# Altium schematic sheet TEST_HJ-185.SchDoc: Test Board
size 419 x 297 mm; Organization: FFT; Address1: Lambertu iela 9; Address2: Marupe; Address3: LV-2167; Address4: Latvia; Revision: E; SheetNumber: 1; SheetTotal: 1; ID: HJ-185 Bluetooth
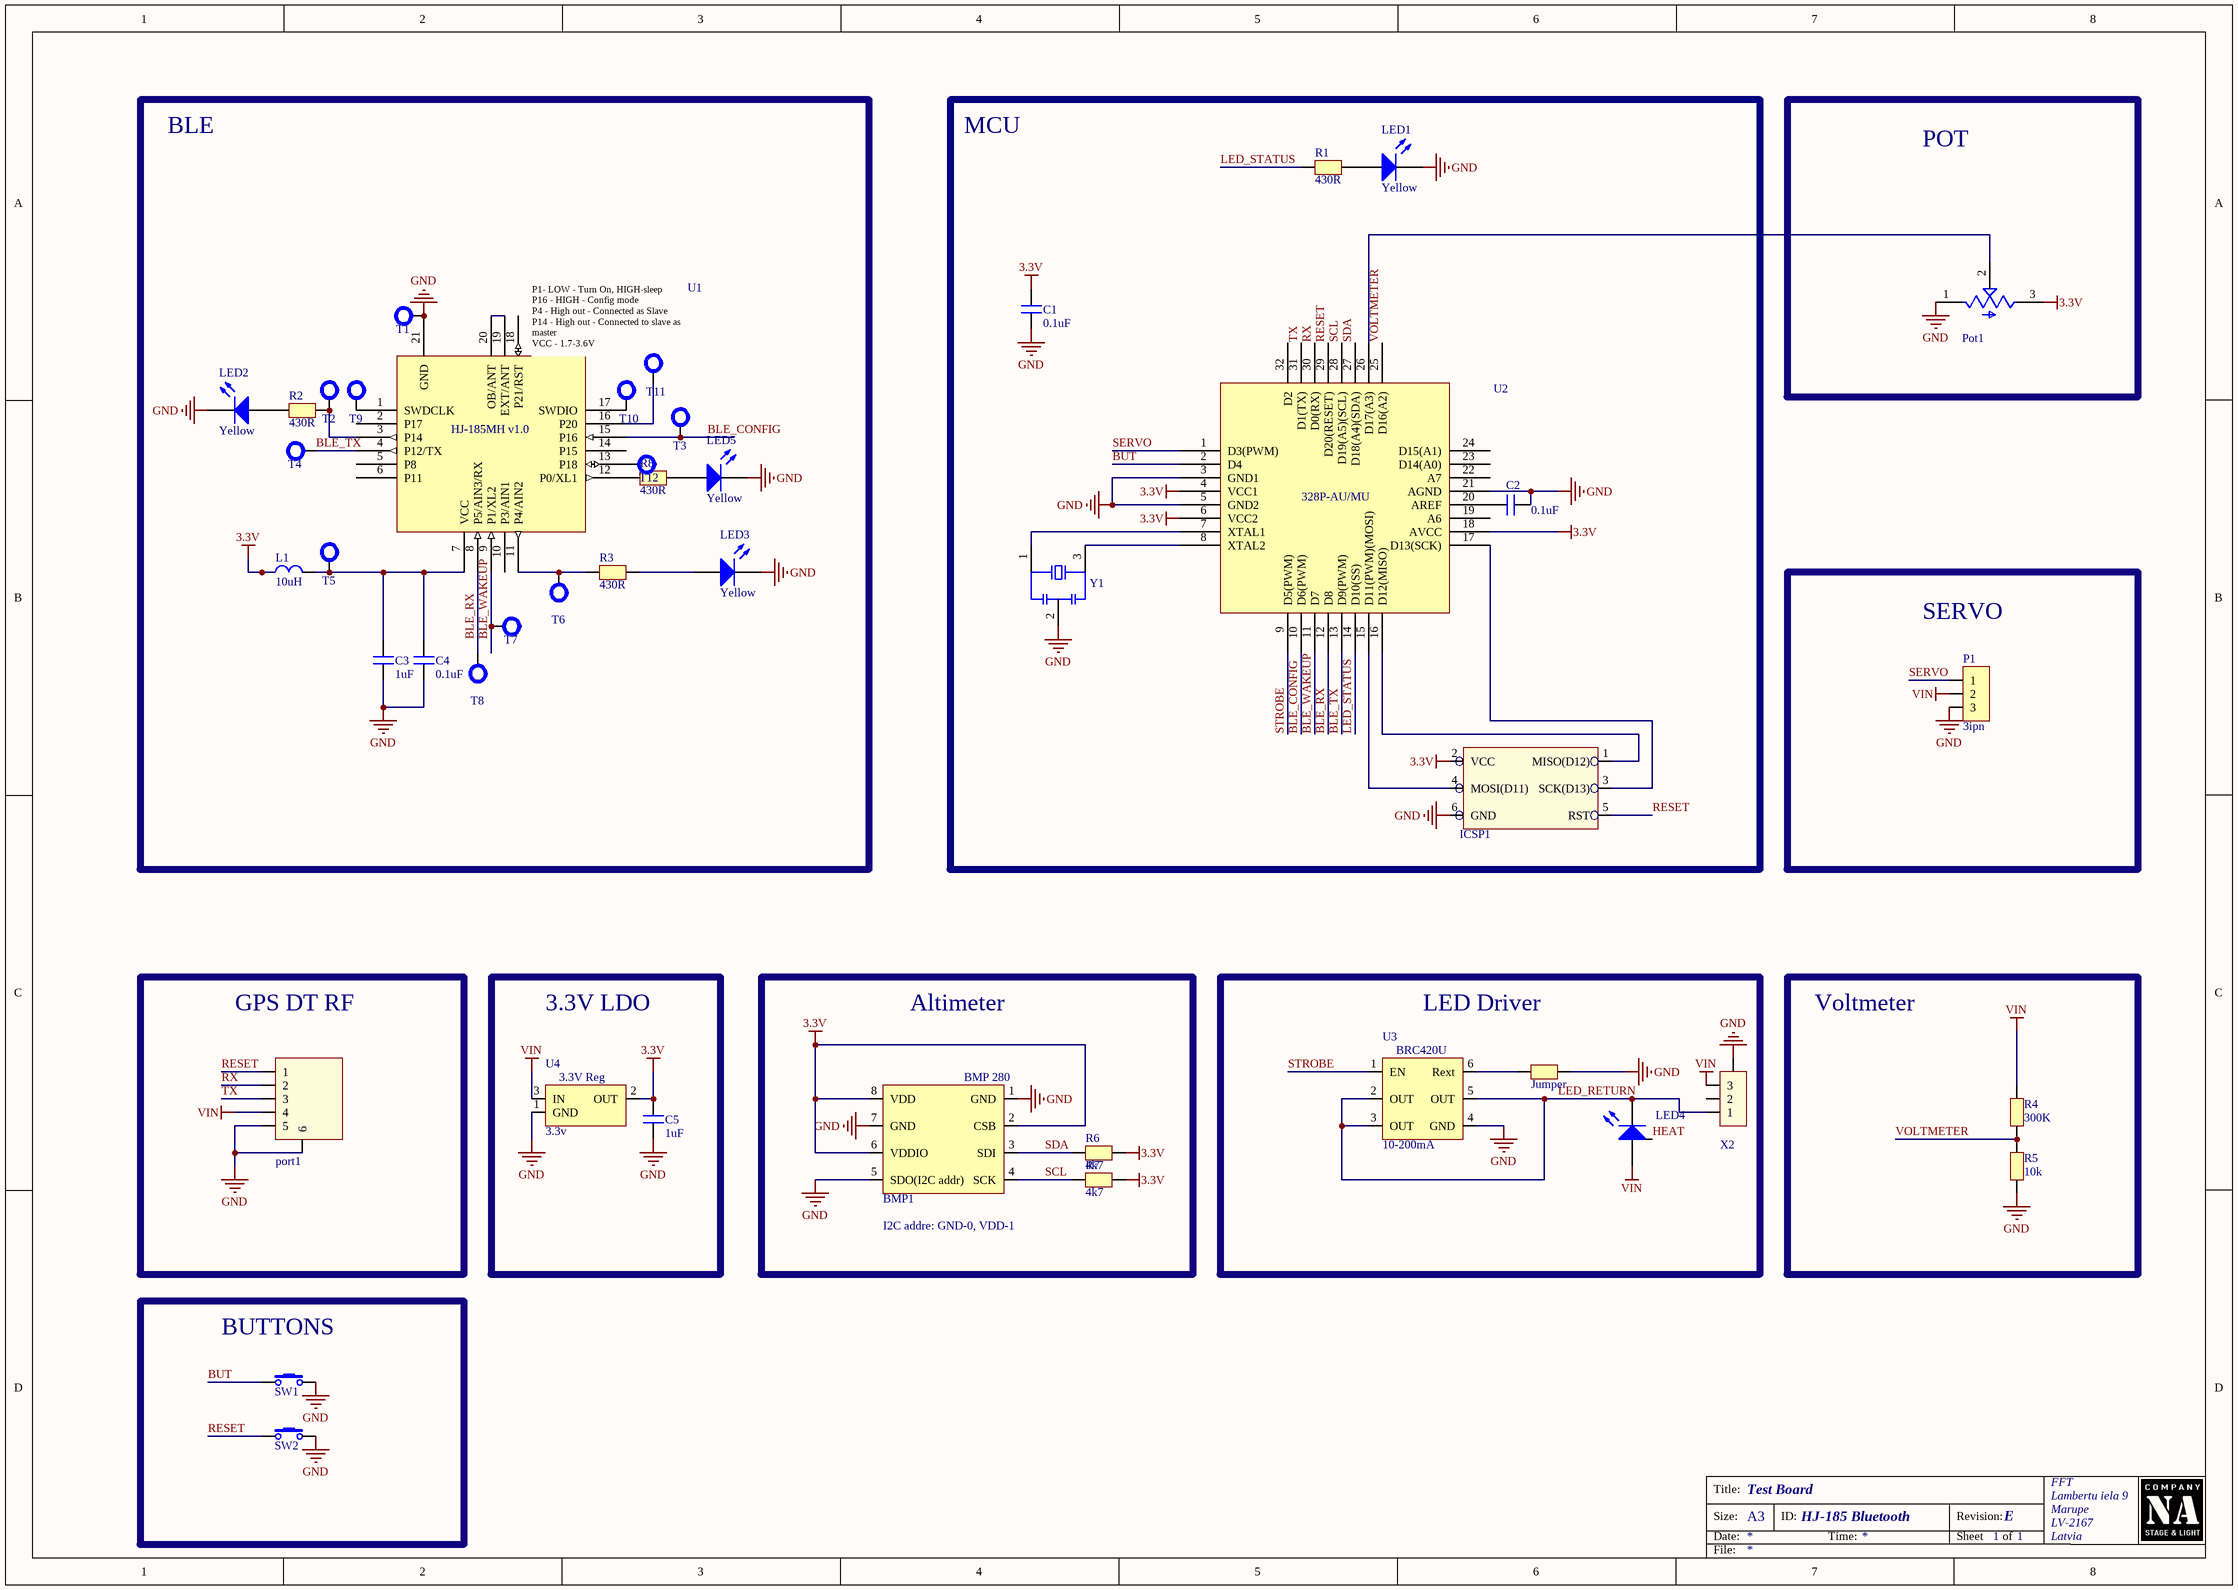
[diagram p0: TEST_HJ-185.SchDoc]

## Parts
BMP1  ± 0.12 hPa equivalent to ±1 m  [BMP280]  (value not drawn)
C1  0.1uF  [C0603-FFT]
C2  0.1uF  [C0603-FFT]
C3  1uF  [C0603-FFT]
C4  0.1uF  [C0603-FFT]
C5  1uF  [C0603-FFT]
ICSP1  Progr ICSP  [ICSP prg PIN 2.54mm]  (value not drawn)  (no BOM)
L1  10uH  [L0603]
LED1  Yellow  [LED0603]
LED2  Yellow  [LED0603]
LED3  Yellow  [LED0603]
LED4  Cool White  [CREE XPL]  (value not drawn)
LED5  Yellow  [LED0603]
P1  3ipn  [HDR1x3]
port1  1.0mm 5pin  [JST 5pin 1mm]  (value not drawn)
Pot1  TC33X-10K  [TrimPot - TC33X-2-101G]  (value not drawn)
R1  430R  [R0603-FFT]
R2  430R  [R0603-FFT]
R3  430R  [R0603-FFT]
R4  300K  [R0603-FFT]
R5  10k  [R0603-FFT]
R6  4k7  [R0603-FFT]
R7  4k7  [R0603-FFT]
R8  430R  [R0603-FFT]
SW1  (no value)  [Switch Tactile SKRPACE010]
SW2  (no value)  [Switch Tactile TS-1088C]
T1  ?  [Test Point]  (value not drawn)  (no BOM)
T2  ?  [Test Point]  (value not drawn)  (no BOM)
T3  ?  [Test Point]  (value not drawn)  (no BOM)
T4  ?  [Test Point]  (value not drawn)  (no BOM)
T5  ?  [Test Point]  (value not drawn)  (no BOM)
T6  ?  [Test Point]  (value not drawn)  (no BOM)
T7  ?  [Test Point]  (value not drawn)  (no BOM)
T8  ?  [Test Point]  (value not drawn)  (no BOM)
T9  ?  [Test Point]  (value not drawn)  (no BOM)
T10  ?  [Test Point]  (value not drawn)  (no BOM)
T11  ?  [Test Point]  (value not drawn)  (no BOM)
T12  ?  [Test Point]  (value not drawn)  (no BOM)
U1  (no value)  [LGA-24-fft]
U2  (no value)  [32-pin QFP 10mm]
U3  10-200mA  [SC74]
U4  3.3v  [SOT23-3]
X1  Jumper  [0603 clear pad]  (no BOM)
X2  1.0mm 3pin  [JST 3pin 1mm]  (value not drawn)
Y1  CSTCE8M0V53-R0  [OSC_CSTCE16M0V53-R0]  (value not drawn)

## Blocks framed on the sheet
BLE: C3 C4 L1 LED2 LED3 LED5 R2 R3 R8 T1-T12 U1
MCU: C1 C2 ICSP1 LED1 R1 U2 Y1
POT: Pot1
SERVO: P1
GPS DT RF: port1
3.3V LDO: C5 U4
Altimeter: BMP1 R6 R7
LED Driver: LED4 U3 X1 X2
Voltmeter: R4 R5
BUTTONS: SW1 SW2

## Nets
3.3V: BMP1.2(CSB) BMP1.6(VDDIO) BMP1.8(VDD) C1.2 C5.2 ICSP1.2(VCC) L1.1 Pot1.3(CW) R6.2 R7.2 U2.4(VCC1) U2.6(VCC2) U2.18(AVCC) U4.2(OUT)
GND: BMP1.1(GND) BMP1.5(SDO(I2C_addr)) BMP1.7(GND) C1.1 C2.2 C3.1 C4.1 C5.1 ICSP1.6(GND) LED1.C LED2.C LED3.C LED5.C P1.3 port1.5 port1.6 Pot1.1(CCW) R5.1 SW1.2 SW2.2 T1.1 U1.21(GND) U2.3(GND1) U2.5(GND2) U2.21(AGND) U3.4(GND) U4.1(GND) X1.1 X2.6(GND) Y1.2(OSC2)
VIN: LED4.A P1.2 port1.4 R4.2 U4.3(IN) X2.3
BLE_CONFIG: T3.1 U1.15(P16) U2.10(D6(PWM))
BLE_RX: T8.1 U1.8(P5/AIN3/RX) U2.12(D8)
BLE_TX: T4.1 U1.4(P12/TX) U2.13(D9(PWM))
BLE_WAKEUP: T7.1 U1.9(P1/XL2) U2.11(D7)
BUT: SW1.1 U2.2(D4)
HEAT: LED4.PAD(P)
LED_RETURN: LED4.K U3.2(OUT) U3.3(OUT) U3.5(OUT) X2.1
LED_STATUS: R1.1 U2.14(D10(SS))
RESET: ICSP1.5(RST) port1.1 SW2.1 U2.29(D20(RESET))
RX: port1.2 U2.30(D0(RX))
SCL: BMP1.4(SCK) R7.1 U2.28(D19(A5)(SCL))
SDA: BMP1.3(SDI) R6.1 U2.27(D18(A4)(SDA))
SERVO: P1.1 U2.1(D3(PWM))
STROBE: U2.9(D5(PWM)) U3.1(EN)
TX: port1.3 U2.31(D1(TX))
VOLTMETER: R4.1 R5.2 U2.25(D16(A2))
NetC2_1: C2.1 U2.20(AREF)
NetC3_2: C3.2 C4.2 L1.2 T5.1 U1.7(VCC)
NetICSP1_1: ICSP1.1(MISO(D12)) U2.16(D12(MISO))
NetICSP1_3: ICSP1.3(SCK(D13)) U2.17(D13(SCK))
NetICSP1_4: ICSP1.4(MOSI(D11)) U2.15(D11(PWM)(MOSI))
NetLED1_A: LED1.A R1.2
NetLED2_A: LED2.A R2.2
NetLED3_A: LED3.A R3.2
NetLED5_A: LED5.A R8.2
NetPot1_2: Pot1.2(W) U2.26(D17(A3))
NetR2_1: R2.1 T2.1 U1.3(P14)
NetR3_1: R3.1 T6.1 U1.11(P4/AIN2)
NetR8_1: R8.1 U1.12(P0/XL1)
NetT9_1: T9.1 U1.1(SWDCLK)
NetT10_1: T10.1 U1.17(SWDIO)
NetT11_1: T11.1 U1.16(P20)
NetT12_1: T12.1 U1.13(P18)
NetU1_19: U1.19(EXT/ANT) U1.20(OB/ANT)
NetU2_7: U2.7(XTAL1) Y1.1(OSC1)
NetU2_8: U2.8(XTAL2) Y1.3(OSC3)
NetU3_6: U3.6(Rext) X1.2

Not connected (* = marked no-connect by the designer): U1 2(P17) 5(P8) 6(P11) 10(P3/AIN1) 14(P15) 18(P21/RST); U2 19(A6) 22(A7) 23(D14(A0)) 24(D15(A1)) 32(D2); X2 2

## Notes on the sheet
- (near BMP1) I2C addre: GND-0, VDD-1
- Title:
- Size:
- Date:
- A3
- ID:
- Time:
- Revision:
- Sheet
- of
- File:
- (in symbol AP2210N-3.3TRG1) 3.3V Reg
- (in symbol Atmega 328P-AU) 328P-AU/MU
- (in symbol HJ-185MH) P1- LOW - Turn On, HIGH-sleep / P16 - HIGH - Config mode / P4 - High out - Connected as Slave / P14 - High out - Connected to slave as master / VCC - 1.7-3.6V /; HJ-185MH v1.0

## Library data of the parts
BMP1 = BMP 280: Pressure sensor; Part Description: BMP 280 Pressure 3.4 μA,0.1 μA(sleep),1.2 ... 3.6 V; Manufacturer: BOSCH; Part Number: 828-1064-1-ND - BMP 280; Part Footprint: LGA-8_2.0x2.5x0.65P; Value: ± 0.12 hPa equivalent to ±1 m; Price: 0.8; LCSC Part #: C83291
C1 C2 C4 = C0603_0.1uF_50V: Part Number: CC0603KRX7R9BB104; Part Description: CAP 0.1uF ±10% 50V X7R -55÷125°C 0603; Manufacturer: YAEGO; PartFootprint: 0603; Value2: 104; Percent: ±10%; Voltage: 50V; Dielectric: X7R; Name: CAP; Packing: Tape; Value: 0.1uF; Temperature: -55÷125°C; Price: 0.005; LCSC Part #: C14663
C3 C5 = C0603_1uF_25V: Part Number: CL10A105KB8NNNC; Part Description: CAP 1uF ±10% 25V X5R -55÷85°C 0603; Manufacturer: SAMSUNG; PartFootprint: 0603; Value2: 105; Percent: ±10%; Voltage: 25V; Dielectric: X5R; Name: CAP; Packing: Tape; Value: 1uF; Temperature: -55÷85°C; Price: 0.01; LCSC Part #: C15849
ICSP1 = Progr ICSP: PAD prog
L1 = L0603_10uH: Inductor; Part Number: 222; Part Description: SMD Inductor 0603; Manufacturer: Aliexpress; Part Footprint: 0603; Percent: ±10%; Value: 10uH; Price: 0.2
LED1-LED3 LED5 = 19-213/Y2C-CQ2R2L/3T(CY): LED 0603 chip; Manufacturer: Everlight Elec; Part Description: YEL LED 0603; Part Footprint: 0603; Part Number: 19-213/Y2C-CQ2R2L/3T(CY); Value: Yellow; Price: 0.01; LCSC Part #: C72038
LED4 = XPL: LED; Manufacturer: CREE; Part Description: High power LED chip 3A; Part Footprint: SMD; Part Number: XPL; Value: Cool White; Price: 2
P1 = Header 3x1: Header 3x1-PIN, 2.54mm; Manufacturer: Connfly; Part Description: 1x3 IDC male header; Part Footprint: THT; Part Number: DS1021-1*3SF1-1; Value: 3pin; Price: 0.1
port1 = SM05B-SRSS-TB: Connector 5p hor 1mm; Manufacturer: JST; Part Footprint: SMD; Part Description: 1.00 mm pitch connector; Value: 1.0mm 5pin; Part Number: SM05B-SRSS-TB; Price: 0.30
Pot1 = TC33X-10K: TrimPot SMD; Part Footprint: 3x3mm; Part Description: Trim potentiometer 10K; Manufacturer: BOURNS; Value: 10K; Part Number: TC33X-10K; Price: 0.07
R1-R3 R8 = R0603_430: SMD resistor; Part Number: 0603WAF4300T5E; Manufacturer: Uniroyal Elec; Part Description: RES 430R ±1% 0.1W -55÷155°C 0603; PartFootprint: 0603; Percent: ±1%; Wattage: 0.1W; Value: 430R; Value2: 430R; Temperature: -55÷155°C; Price: 0.002; LCSC Part #: C23170
R4 = R0603_300k: SMD resistor; Part Number: 0603WAF3003T5E; Manufacturer: Uniroyal Elec; Part Description: RES 300K ±1% 0.1W -55÷155°C 0603; PartFootprint: 0603; Percent: ±1%; Wattage: 0.1W; Value: 300K; Value2: 300k; Temperature: -55÷155°C; LCSC Part #: C23024; Price: 0.002
R5 = R0603_10k: SMD resistor; Part Number: 0603WAF1002T5E; Manufacturer: Uniroyal Elec; Part Description: RES 10k ±1% 0.1W -55÷155°C 0603; PartFootprint: 0603; Percent: ±1%; Wattage: 0.1W; Value: 10k; Value2: 10K; Temperature: -55÷155°C; LCSC Part #: C25804; Price: 0.002
R6 R7 = R0603_4k7: SMD resistor; Part Number: SMD0603-4K7-1%; Manufacturer: Yageo; Part Description: RES 4k7 ±1% 0.1W -55÷155°C 0603; PartFootprint: 0603; Percent: ±1%; Wattage: 0.1W; Value: 4k7; Value2: 4K7; Temperature: -55÷155°C; Price: 0.01; LCSC Part #: *
SW1 = SKRPACE010: Switch Tactile; Part Description: Tactile switch, 3.2x4.2x2.5mm 50mA; Manufacturer: ALPS; PartFootprint: SMD 3.3x4.2; Temperature: -25÷70°C; Part Number: SKRPACE010; Price: 0.07
SW2 = TS-1088C-02526: Switch Tactile; Part Description: Tactile switch, 3x4.2x2.5mm 50mA; Manufacturer: XUNPU; PartFootprint: SMD 3x4mm; Temperature: -25÷70°C; Part Number: TS-1088C-02526; Price: 0.07
T1-T12 = Test Point: Part Number: C0402; PartFootprint: 0402; Percent: ±10%; Value: ?; Part Description: =Name+' '+Value+' '+Percent+' '+Voltage+' '+Dielectric+' '+Temperature+' '+PartFootprint; Manufacturer: ?
U1 = HJ-185MH: Module BLE; Part Number: HJ-185IMH_SPPv2; Manufacturer: tshjdz.com; Part Footprint: LGA-24; Part Description: BLE Module 5.5x5.5mm, inbuilt antenna; Price: 4; LCSC Part #: ---
U2 = Atmega 328P-AU: MCU; Manufacturer: Microchip Tech; Part Footprint: TQFP-32_7.0x7.0x0.8P; Part Number: ATmega 328p-AU; Part Description: MCU; Price: 1.3; LCSC Part #: C14877
U3 = BRC420U: LED Driver 10-200mA; Manufacturer: Infeon; Part Number: BCR421UE6327; Part Description: LED Driver 10-200mA; Part Footprint: SC74; Value: 10-200mA; Price: 0.1
U4 = AP2210N-3.3TRG1: LDO 3.3V 300mA; Part Footprint: SOT-23-3; Part Number: MIC5209; Manufacturer: DIODES INCORPORATED; Part Description: LDO 3.3V 0.3A; Value: 3.3v; Price: 0.08
X1 = Jumper 0603: Pad; Part Number: 1212; Part Description: 0; Part Footprint: 0603; Value: clear pad; Manufacturer: clear pad; Percent: 0; Price: 0
X2 = SM03B-SRSS-TB: Connector 3p hor 1mm; Manufacturer: JST; Part Number: SM05B-SRSS-TB; Part Footprint: SMD; Part Description: 1.00 mm pitch connector, horizontal; Value: 1.0mm 3pin; Price: 0.30
Y1 = CSTCE8M0V53-R0: Ceramic Resonator 8Mhz; Manufacturer: Murata; Part Footprint: SMD-3 Murata; Part Description: 8MHz Ceramic Resonator Built in Cap 15pF ±0.3% -20°C ~ 80°C SMD; Part Number: CSTCE8M0V53-R0_1; Price: 0.37; Value: 8MHz